# Altium schematic sheet sensors.SchDoc
size A4
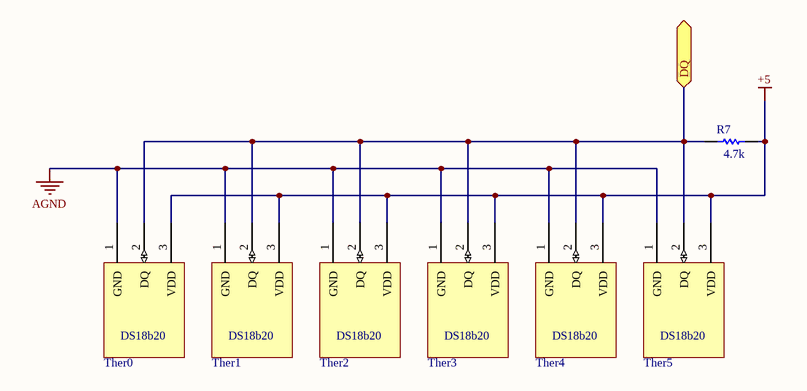
[diagram p0: sensors.SchDoc]

## Parts
R7  value 4.7k  [0805(M)]  (hidden comment: Res)
Ther0  18b20  [TO-92A(DIP)]  (value not drawn)
Ther1  18b20  [TO-92A(DIP)]  (value not drawn)
Ther2  18b20  [TO-92A(DIP)]  (value not drawn)
Ther3  18b20  [TO-92A(DIP)]  (value not drawn)
Ther4  18b20  [TO-92A(DIP)]  (value not drawn)
Ther5  18b20  [TO-92A(DIP)]  (value not drawn)

## Ports
DQ (bidir)

## Nets
+5: R7.2 Ther0.3(VDD) Ther1.3(VDD) Ther2.3(VDD) Ther3.3(VDD) Ther4.3(VDD) Ther5.3(VDD)
AGND: Ther0.1(GND) Ther1.1(GND) Ther2.1(GND) Ther3.1(GND) Ther4.1(GND) Ther5.1(GND)
DQ: R7.1 Ther0.2(DQ) Ther1.2(DQ) Ther2.2(DQ) Ther3.2(DQ) Ther4.2(DQ) Ther5.2(DQ) ; port DQ

## Notes on the sheet
- (in symbol 18b20) DS18b20

## Library data of the parts
Ther0-Ther5 = 18b20: DS18B20 Programmable Resolution 1-Wire® Digital Thermometer